# Altium schematic sheet barun module.schdoc
size A4
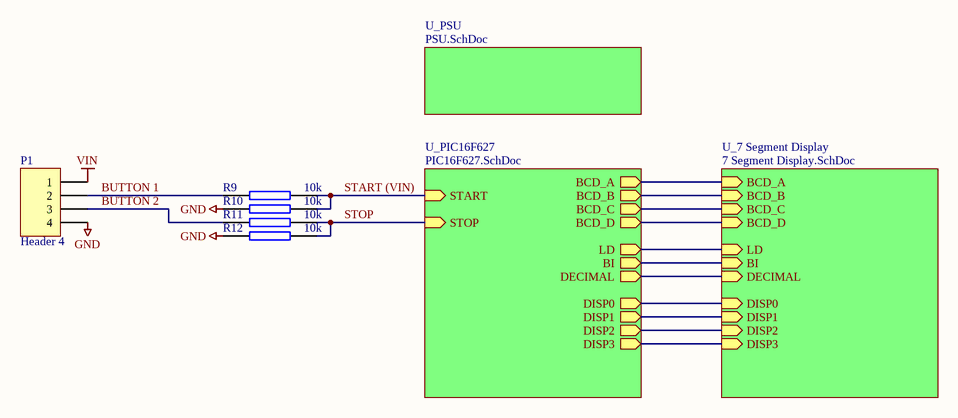
[diagram p0: barun module.schdoc]

## Parts
P1  Header 4  [4 x 5.08mm]
R9  10k  [RES (3D) - 0603]
R10  10k  [RES (3D) - 0603]
R11  10k  [RES (3D) - 0603]
R12  10k  [RES (3D) - 0603]

## Sub-sheets
U_7 Segment Display = 7 Segment Display.SchDoc: BCD_A (in), BCD_B (in), BCD_C (in), BCD_D (in), LD (in), BI (in), DISP0 (in), DISP1 (in), DISP2 (in), DISP3 (in), DECIMAL (in)
U_PIC16F627 = PIC16F627.SchDoc: BCD_A (out), BCD_B (out), BCD_C (out), BCD_D (out), LD (out), BI (out), DISP0 (out), DISP1 (out), DISP2 (out), DISP3 (out), DECIMAL (out), START (in), STOP (in)
U_PSU = PSU.SchDoc: no entries

## Nets
GND: P1.4 R10.1 R12.1
VIN: P1.1
BUTTON 1: P1.2 R9.1
BUTTON 2: P1.3 R11.1
START (VIN): R9.2 R10.2 ; sheet U_PIC16F627/START
STOP: R11.2 R12.2 ; sheet U_PIC16F627/STOP
(unnamed): sheet U_7 Segment Display/BCD_A, sheet U_PIC16F627/BCD_A
(unnamed): sheet U_7 Segment Display/BCD_B, sheet U_PIC16F627/BCD_B
(unnamed): sheet U_7 Segment Display/BCD_C, sheet U_PIC16F627/BCD_C
(unnamed): sheet U_7 Segment Display/BCD_D, sheet U_PIC16F627/BCD_D
(unnamed): sheet U_7 Segment Display/LD, sheet U_PIC16F627/LD
(unnamed): sheet U_7 Segment Display/BI, sheet U_PIC16F627/BI
(unnamed): sheet U_7 Segment Display/DISP0, sheet U_PIC16F627/DISP0
(unnamed): sheet U_7 Segment Display/DISP1, sheet U_PIC16F627/DISP1
(unnamed): sheet U_7 Segment Display/DISP2, sheet U_PIC16F627/DISP2
(unnamed): sheet U_7 Segment Display/DISP3, sheet U_PIC16F627/DISP3
(unnamed): sheet U_7 Segment Display/DECIMAL, sheet U_PIC16F627/DECIMAL

## Library data of the parts
P1 = Header 4: Header, 4-Pin; Manufacturer: Phoenix Contact; Manufacturer Part No.: 1733596; value: 4 x 5.08mm; Mouser Part no.: 651-1733596; Web link: http://au.mouser.com/ProductDetail/Phoenix-Contact/1733596/?qs=8BCRtFWWXOQoaU9FOMDU4Q%3d%3d
R9-R12 = RES SMD 0603 10k: RESISTOR SMD 0603 10k; Manufacturer: Bourns; Manufacturer Part No.: CR0603FX-1002ELF; Mouser Part no.: 652-CR0603FX-1002ELF; Web link: http://au.mouser.com/ProductDetail/Bourns/CR0603-FX-1002ELF/?qs=sGAEpiMZZMu61qfTUdNhG6LqqFhkr6pUNCm4S5639HA%3d; value: 10k